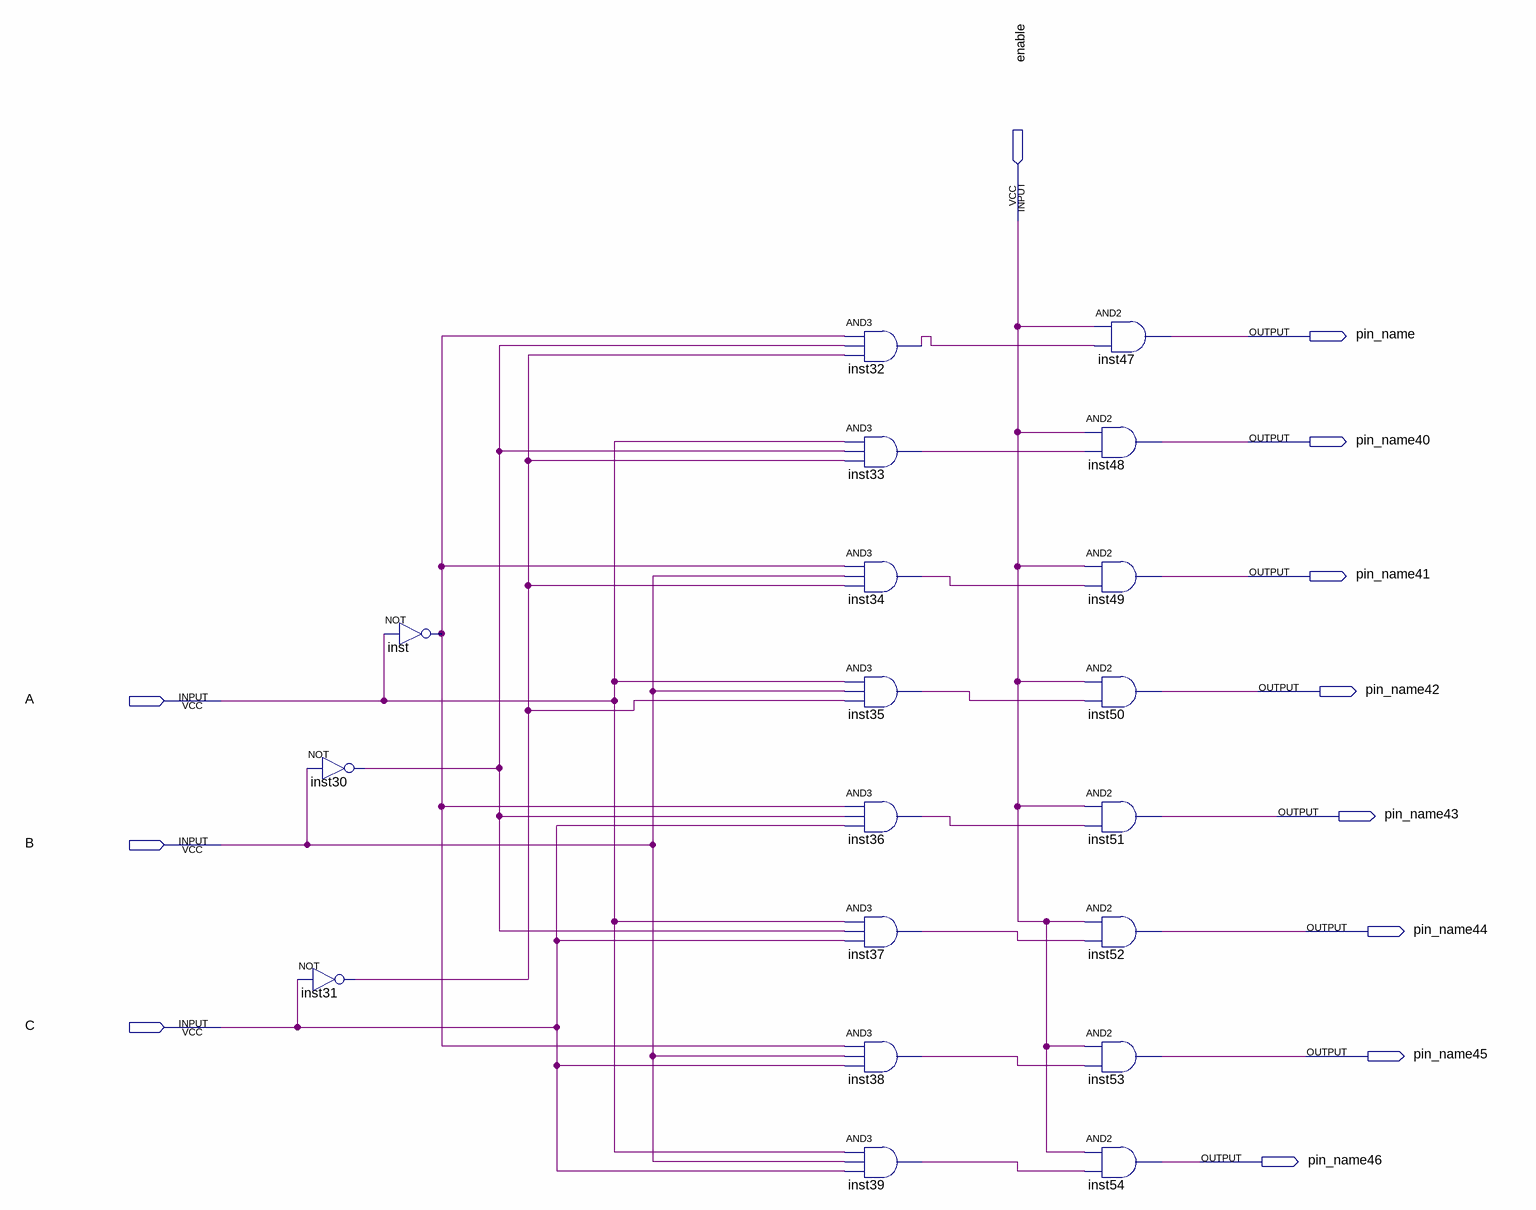
[diagram p0: schematic sheet]
// Quartus schematic lab02_1.bdf as structural Verilog: 19 symbols, 12 pins
module lab02_1 (
  input  enable,
  input  A,
  input  B,
  input  C,
  output pin_name,
  output pin_name40,
  output pin_name41,
  output pin_name42,
  output pin_name43,
  output pin_name44,
  output pin_name45,
  output pin_name46
);

  wire inst30_out, inst31_out, inst32_out, inst33_out, inst34_out, inst35_out, inst36_out, inst37_out,
       inst38_out, inst39_out, inst_out;

  not inst30 (inst30_out, B);
  not inst31 (inst31_out, C);
  not inst (inst_out, A);
  and inst32 (inst32_out, inst_out, inst30_out, inst31_out);
  and inst33 (inst33_out, A, inst30_out, inst31_out);
  and inst34 (inst34_out, inst_out, B, inst31_out);
  and inst35 (inst35_out, A, B, inst31_out);
  and inst36 (inst36_out, inst_out, inst30_out, C);
  and inst37 (inst37_out, A, inst30_out, C);
  and inst38 (inst38_out, inst_out, B, C);
  and inst39 (inst39_out, A, B, C);
  and inst47 (pin_name, enable, inst32_out);
  and inst48 (pin_name40, enable, inst33_out);
  and inst49 (pin_name41, enable, inst34_out);
  and inst50 (pin_name42, enable, inst35_out);
  and inst51 (pin_name43, enable, inst36_out);
  and inst52 (pin_name44, enable, inst37_out);
  and inst53 (pin_name45, enable, inst38_out);
  and inst54 (pin_name46, enable, inst39_out);
endmodule
